# Altium schematic sheet Sheet1.SchDoc
size A; SheetNumber: 1; SheetTotal: 2
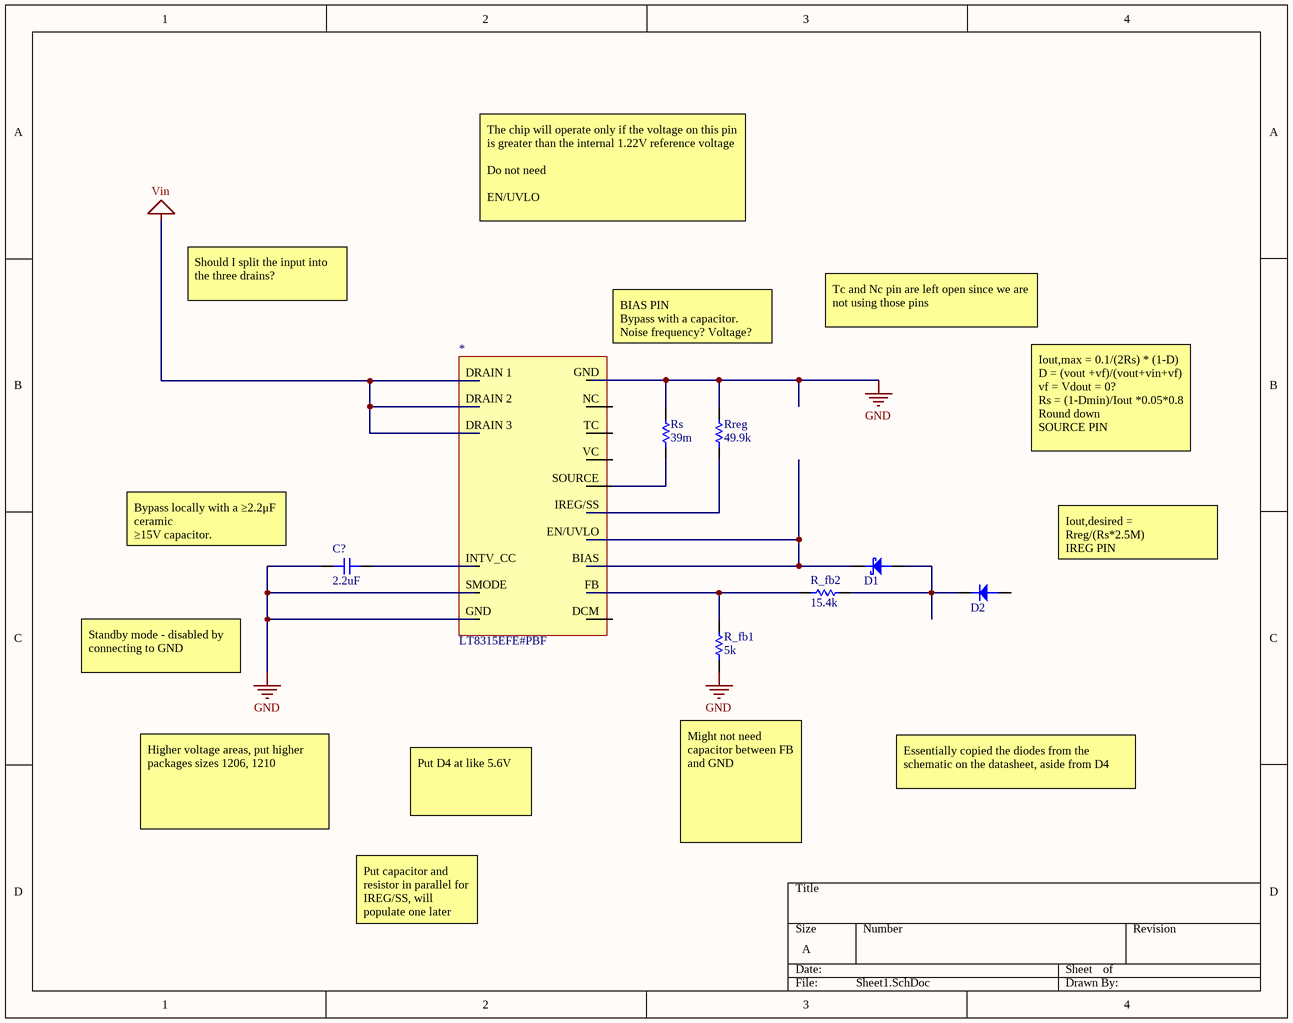
[diagram p0: Sheet1.SchDoc]

## Parts
*  LT8315EFE#PBF  [TSOP65P650X120-20N]
C?  2.2uF  [CAPC1608X06N]
D1  CMDSH2-3 TR PBFREE  (value not drawn)
D2  CMMR1U-06TRPBFREE  (value not drawn)
R_fb1  5k  [RESC0603X03N]
R_fb2  15.4k  [RESC1005X04N]
Rreg  49.9k  [RESC3115X07N]
Rs  39m

## Nets
GND: C?.1 R_fb1.1 Rreg.2 Rs.2
Vin: *.DRAIN_1 *.DRAIN_2 *.DRAIN_3
Net*_BIAS: *.BIAS *.EN/UVLO D1.1
Net*_FB: *.FB R_fb1.2 R_fb2.1
Net*_IREG/SS: *.IREG/SS Rreg.1
NetD1_2: D1.2 D2.1 R_fb2.2

Not connected (* = marked no-connect by the designer): * DCM GND INTV_CC NC SMODE SOURCE TC VC; C? 2; D2 2; Rs 1

## Notes on the sheet
- The chip will operate only if the voltage on this pin is greater than the internal 1.22V reference voltage
  Do not need
  EN/UVLO
- Should I split the input into the three drains?
- (near *) BIAS PIN
  Bypass with a capacitor.
  Noise frequency? Voltage?
- Tc and Nc pin are left open since we are not using those pins
- Iout,max = 0.1/(2Rs) * (1-D)
  D = (vout +vf)/(vout+vin+vf)
  vf = Vdout = 0?
  Rs = (1-Dmin)/Iout *0.05*0.8
  Round down
  SOURCE PIN
- (near C?) Bypass locally with a ≥2.2μF ceramic
  ≥15V capacitor.
- Iout,desired = Rreg/(Rs*2.5M)
  IREG PIN
- Standby mode - disabled by connecting to GND
- Higher voltage areas, put higher packages sizes 1206, 1210
- Put D4 at like 5.6V
- Might not need capacitor between FB and GND
- Essentially copied the diodes from the schematic on the datasheet, aside from D4
- Put capacitor and resistor in parallel for IREG/SS, will populate one later

## Library data of the parts
* = LT8315EFE#PBF: IC REG CTRLR FLYBACK 20TSSOP; Manufacturer: Analog Devices / Linear Technology; Supplier 1: Digi-Key; Manufacturer Part Number: LT8315EFE#PBF; RoHS: Yes; Category: Voltage Regulators - Switching; Stock 1: 22; Pricing 1: 1=9.84000, 10=8.88800, 25=8.47480, 100=7.35850, 250=7.02780, 500=6.43500 (USD); RoHS Compliant: Yes; ComponentLink1URL: http://www.linear.com/docs/56703?src-supplier=Digi-Key; ComponentLink1Description: http://www.linear.com/docs/56703?src-supplier=Digi-Key; Supplier Part Number 1: LT8315EFE#PBF-ND
C? = EMK107BBJ225MK-T: CAP CER 2.2UF 16V X5R 0603; Manufacturer: Taiyo Yuden; Tolerance: 20%; Supplier 1: Digi-Key; Manufacturer Part Number: EMK107BBJ225MK-T; RoHS: Yes; Category: Ceramic Capacitors; Stock 1: 6186; Pricing 1: 1=0.27000, 10=0.18800, 50=0.12560, 100=0.10670, 500=0.07534, 1000=0.06593 (USD); Mount: Surface Mount; Case/Package: 0603; Min Operating Temperature: -55°C; Max Operating Temperature: 85°C; Packaging: Cut Tape; Capacitance: 2.2uF; Voltage Rating: 16V; RoHS Compliant: Yes; ComponentLink1URL: http://ds.yuden.co.jp/TYCOMPAS/ut/detail.do?productNo=EMK107BBJ225MK-T&fileName=EMK107BBJ225MK-T_SS&mode=specSheetDownload&src-supplier=Digi-Key; ComponentLink1Description: http://ds.yuden.co.jp/TYCOMPAS/ut/detail.do?productNo=EMK107BBJ225MK-T&fileName=EMK107BBJ225MK-T_SS&mode=specSheetDownload&src-supplier=Digi-Key; Supplier Part Number 1: 587-4866-1-ND
D1 = CMDSH2-3 TR PBFREE: Silicon SCHOTTKY Diode High Current 30V 1A 2-Pin SOD-323 Surface Mount T/R; Manufacturer: Central Semiconductor; Supplier 1: Digi-Key; Manufacturer Part Number: CMDSH2-3 TR PBFREE; RoHS: Yes; Stock 1: 40881; Pricing 1: 1=0.65000, 10=0.57200, 100=0.43830, 500=0.34650, 1000=0.27720 (USD); RoHS Compliant: Yes; Supplier Part Number 1: 1514-CMDSH2-3TRPBFREECT-ND
D2 = CMMR1U-06TRPBFREE: Diode Switching 600V 1A Automotive 2-Pin SOD-123F T/R; Manufacturer: Central Semiconductor; Forward Voltage: 1.7V; Peak Non-Repetitive Surge Current: 30A; Element Configuration: Single; Supplier 1: Digi-Key; Manufacturer Part Number: CMMR1U-06TRPBFREE; RoHS: Yes; Category: Uncategorized; Stock 1: 10653; Pricing 1: 1=0.82000, 10=0.72600, 100=0.55660, 500=0.44000, 1000=0.35200 (USD); Mount: Surface Mount; Case/Package: SOD; Number of Pins: 2; Min Operating Temperature: -65°C; Max Operating Temperature: 150°C; Packaging: Tape and Reel; Radiation Hardening: No; RoHS Compliant: Yes; ComponentLink1URL: https://datasheet.ciiva.com/26939/getdatasheetpartid-707878-26939601.pdf?src-supplier=Verical; ComponentLink1Description: https://datasheet.ciiva.com/26939/getdatasheetpartid-707878-26939601.pdf?src-supplier=Verical; Supplier Part Number 1: 1514-CMMR1U-06TRPBFREECT-ND
R_fb1 = TNPW02015K00BEED: Manufacturer: Vishay Dale; Supplier 1: Digi-Key; Manufacturer Part Number: TNPW02015K00BEED; RoHS: No; Stock 1: 3323; Pricing 1: 1=0.48000, 10=0.36500, 100=0.15350, 1000=0.08467, 2500=0.07938, 5000=0.07144 (USD); Supplier Part Number 1: 541-TNPW02015K00BEEDCT-ND
R_fb2 = ERJ-2RKF1542X: GLOVE, POLYAMIDE, L/FREE, PU, SIZE 6 - More Details; Manufacturer: Panasonic; Resistance: 15.4kR; Tolerance: 1%; Power Rating: 100mW; Voltage Rating: 50V; Temperature Coefficient: 100ppm/°C; Supplier 1: Digi-Key; Manufacturer Part Number: ERJ-2RKF1542X; RoHS: Yes; Category: Chip SMD Resistors; Stock 1: 11260; Pricing 1: 1=0.10000, 10=0.02500, 100=0.01020, 1000=0.00457, 2500=0.00397, 5000=0.00328 (USD); Mount: Surface Mount; Case/Package: 0402; Case Code (Imperial): 0402; Case Code (Metric): 1005; Contact Plating: Tin; Weight: 2.8E-05oz; Min Operating Temperature: -55°C; Max Operating Temperature: 155°C; Packaging: Tape and Reel; Package Quantity: 1; Resistor Type: Thick Film; Termination: SMD/SMT; Number of Terminations: 2; Max Power Dissipation: 100mW; Voltage Rating (DC): 50V; Features: Automotive AEC-Q200; Series: ERJ; Resistance Tolerance: 1%; Technology: THICK FILM; Construction: Rectangular; Length: 1mm; Width: 0.5mm; Height: 0.35mm; Depth: 0.5mm; Radiation Hardening: No; REACH SVHC: Yes; Military Standard: Not; RoHS Compliant: Yes; Lead Free: Lead Free; ComponentLink1URL: https://datasheet.ciiva.com/22774/1678782-22774075.pdf?src-supplier=Farnell; ComponentLink1Description: https://datasheet.ciiva.com/22774/1678782-22774075.pdf?src-supplier=Farnell; ComponentLink2URL: https://datasheet.ciiva.com/24163/aoa0000ce2-24163722.pdf?src-supplier=Mouser; ComponentLink2Description: https://datasheet.ciiva.com/24163/aoa0000ce2-24163722.pdf?src-supplier=Mouser; ComponentLink3URL: https://datasheet.ciiva.com/30091/aoa0000ce2-30091305.pdf?src-supplier=Onlinecomponents.com; ComponentLink3Description: https://datasheet.ciiva.com/30091/aoa0000ce2-30091305.pdf?src-supplier=Onlinecomponents.com; ComponentLink4URL: https://datasheet.ciiva.com/46436/1678782-46436982.pdf?src-supplier=Element14; ComponentLink4Description: https://datasheet.ciiva.com/46436/1678782-46436982.pdf?src-supplier=Element14; ComponentLink5URL: https://datasheet.ciiva.com/16760/70260748-16760316.pdf?src-supplier=Allied+Electronics; ComponentLink5Description: https://datasheet.ciiva.com/16760/70260748-16760316.pdf?src-supplier=Allied+Electronics; ComponentLink6URL: https://datasheet.ciiva.com/16761/70260748-16761511.pdf?src-supplier=Allied+Electronics; ComponentLink6Description: https://datasheet.ciiva.com/16761/70260748-16761511.pdf?src-supplier=Allied+Electronics; ComponentLink7URL: https://datasheet.ciiva.com/22681/1678782-22681271.pdf?src-supplier=Element14; ComponentLink7Description: https://datasheet.ciiva.com/22681/1678782-22681271.pdf?src-supplier=Element14; Supplier Part Number 1: P15.4KLCT-ND
Rreg = ERJ-8ENF4992V: RES SMD 49.9K OHM 1% 1/4W 1206; Manufacturer: Panasonic; Resistance: 49.9kR; Temperature Coefficient: 100ppm/°C; Voltage Rating: 200V; Power Rating: 250mW; Supplier 1: Digi-Key; Manufacturer Part Number: ERJ-8ENF4992V; RoHS: Yes; Category: Chip SMD Resistors; Stock 1: 75366; Pricing 1: 1=0.10000, 10=0.09300, 100=0.03560, 1000=0.01569, 2500=0.01355 (USD); Mount: Surface Mount; Case/Package: 1206; Contact Plating: Tin; Case Code (Metric): 3216; Case Code (Imperial): 1206; Min Operating Temperature: -55°C; Max Operating Temperature: 155°C; Tolerance: 1%; Resistor Type: Thick Film; Packaging: Tape and Reel; Package Quantity: 1; Number of Terminations: 2; Termination: SMD/SMT; Max Power Dissipation: 250mW; Voltage Rating (DC): 200V; Series: ERJ; Construction: Rectangular; Resistance Tolerance: 1%; Features: Automotive AEC-Q200; Length: 3.2mm; Width: 0.063inch; Height: 0.028inch; Depth: 1.6mm; Radiation Hardening: No; REACH SVHC: Unknown; Military Standard: Not; RoHS Compliant: Yes; Lead Free: Contains Lead; ComponentLink1URL: https://datasheet.ciiva.com/6064/426256-6064697.pdf?src-supplier=Farnell; ComponentLink1Description: https://datasheet.ciiva.com/6064/426256-6064697.pdf?src-supplier=Farnell; ComponentLink2URL: https://datasheet.ciiva.com/46377/426256-46377947.pdf?src-supplier=Element14; ComponentLink2Description: https://datasheet.ciiva.com/46377/426256-46377947.pdf?src-supplier=Element14; ComponentLink3URL: https://datasheet.ciiva.com/28548/1678782-28548377.pdf?src-supplier=Element14; ComponentLink3Description: https://datasheet.ciiva.com/28548/1678782-28548377.pdf?src-supplier=Element14; ComponentLink4URL: https://datasheet.ciiva.com/28694/1678782-28694249.pdf?src-supplier=Element14; ComponentLink4Description: https://datasheet.ciiva.com/28694/1678782-28694249.pdf?src-supplier=Element14; ComponentLink5URL: https://datasheet.ciiva.com/24026/aoa0000ce2-24026814.pdf?src-supplier=Mouser; ComponentLink5Description: https://datasheet.ciiva.com/24026/aoa0000ce2-24026814.pdf?src-supplier=Mouser; ComponentLink6URL: https://datasheet.ciiva.com/16772/70260748-16772229.pdf?src-supplier=Allied+Electronics; ComponentLink6Description: https://datasheet.ciiva.com/16772/70260748-16772229.pdf?src-supplier=Allied+Electronics; ComponentLink7URL: https://datasheet.ciiva.com/16724/70260748-16724652.pdf?src-supplier=Allied+Electronics; ComponentLink7Description: https://datasheet.ciiva.com/16724/70260748-16724652.pdf?src-supplier=Allied+Electronics; ComponentLink8URL: https://datasheet.ciiva.com/9189/aoa0000ce2-9189145.pdf?src-supplier=Avnet; ComponentLink8Description: https://datasheet.ciiva.com/9189/aoa0000ce2-9189145.pdf?src-supplier=Avnet; ComponentLink9URL: https://datasheet.ciiva.com/30219/aoa0000ce2-30219902.pdf?src-supplier=Onlinecomponents.com; ComponentLink9Description: https://datasheet.ciiva.com/30219/aoa0000ce2-30219902.pdf?src-supplier=Onlinecomponents.com; ComponentLink10URL: https://datasheet.ciiva.com/17209/aoa0000ce2-17209499.pdf?src-supplier=Avnet+Europe; ComponentLink10Description: https://datasheet.ciiva.com/17209/aoa0000ce2-17209499.pdf?src-supplier=Avnet+Europe; ComponentLink11URL: https://datasheet.ciiva.com/16513/aoa0000ce2-16513653.pdf?src-supplier=Avnet+Asia; ComponentLink11Description: https://datasheet.ciiva.com/16513/aoa0000ce2-16513653.pdf?src-supplier=Avnet+Asia; Supplier Part Number 1: P49.9KFCT-ND
Rs = ERJ-8CWJR039V: Res Thick Film 1206 0.039 Ohm 5% 1W 50ppm/C Molded SMD SMD Punched Carrier T/R; Manufacturer: Panasonic; Resistance: 39mR; Temperature Coefficient: 75ppm/°C; Supplier 1: Digi-Key; Manufacturer Part Number: ERJ-8CWJR039V; RoHS: Yes; Category: Chip SMD Resistors; Stock 1: 4176; Pricing 1: 1=0.54000, 10=0.41700, 100=0.17540, 1000=0.09678, 2500=0.09074 (USD); Mount: Surface Mount; Case/Package: 1206; Case Code (Metric): 3216; Case Code (Imperial): 1206; Min Operating Temperature: -55°C; Max Operating Temperature: 125°C; Packaging: Tape and Reel; Power Rating: 1W; Tolerance: 5%; Resistor Type: Thick Film; Number of Terminations: 2; Max Power Dissipation: 1W; Features: Automotive AEC-Q200; Length: 0.126inch; Width: 0.063inch; Height: 0.03inch; ComponentLink1URL: https://media.digikey.com/pdf/Data%20Sheets/Panasonic%20Resistors%20Thermistors%20PDFs/ERJ-8CW_Series_LE.pdf?src-supplier=Digi-Key; ComponentLink1Description: https://media.digikey.com/pdf/Data%20Sheets/Panasonic%20Resistors%20Thermistors%20PDFs/ERJ-8CW_Series_LE.pdf?src-supplier=Digi-Key; ComponentLink2URL: http://www.mouser.com/ds/2/315/AOA0000C295-1109214.pdf?src-supplier=Mouser; ComponentLink2Description: http://www.mouser.com/ds/2/315/AOA0000C295-1109214.pdf?src-supplier=Mouser; ComponentLink3URL: http://www.onlinecomponents.com/datasheet/erj-8cwjr039v.aspx?p=44454211&src-supplier=Onlinecomponents.com; ComponentLink3Description: http://www.onlinecomponents.com/datasheet/erj-8cwjr039v.aspx?p=44454211&src-supplier=Onlinecomponents.com; ComponentLink4URL: https://industrial.panasonic.com/cdbs/www-data/pdf/RDN0000/AOA0000C313.pdf?src-supplier=Digi-Key; ComponentLink4Description: https://industrial.panasonic.com/cdbs/www-data/pdf/RDN0000/AOA0000C313.pdf?src-supplier=Digi-Key; ComponentLink5URL: http://industrial.panasonic.com/www-data/pdf/AOA0000/AOA0000CE3.pdf?src-supplier=Avnet; ComponentLink5Description: http://industrial.panasonic.com/www-data/pdf/AOA0000/AOA0000CE3.pdf?src-supplier=Avnet; Supplier Part Number 1: P0.039BWCT-ND